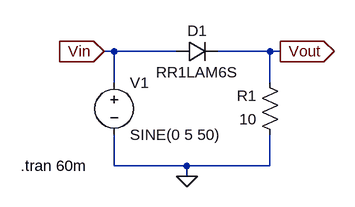
[diagram p0: schematic Draft15.asc]
Draft15.asc, the LTspice schematic file:
Version 4
SHEET 1 880 680
WIRE 16 64 0 64
WIRE 112 64 16 64
WIRE 256 64 176 64
WIRE 272 64 256 64
WIRE 16 112 16 64
WIRE 256 112 256 64
WIRE 16 240 16 192
WIRE 128 240 16 240
WIRE 256 240 256 192
WIRE 256 240 128 240
WIRE 128 256 128 240
FLAG 128 256 0
FLAG 272 64 Vout
IOPIN 272 64 Out
FLAG 0 64 Vin
IOPIN 0 64 In
SYMBOL diode 112 80 R270
WINDOW 0 32 32 VTop 2
WINDOW 3 0 32 VBottom 2
SYMATTR InstName D1
SYMATTR Value RR1LAM6S
SYMBOL res 272 208 R180
WINDOW 0 36 76 Left 2
WINDOW 3 36 40 Left 2
SYMATTR InstName R1
SYMATTR Value 10
SYMBOL voltage 16 96 R0
WINDOW 123 0 0 Left 0
WINDOW 39 0 0 Left 0
SYMATTR InstName V1
SYMATTR Value SINE(0 5 50)
TEXT -128 240 Left 2 !.tran 60m

The netlist it stands for:
* Draft15.asc
D1 Vin Vout RR1LAM6S
R1 0 Vout 10
V1 Vin 0 SINE(0 5 50)
.model D D
.lib standard.dio
.tran 60m
.backanno
.end

* Results of the author's LTspice run, read from the files saved beside the schematic
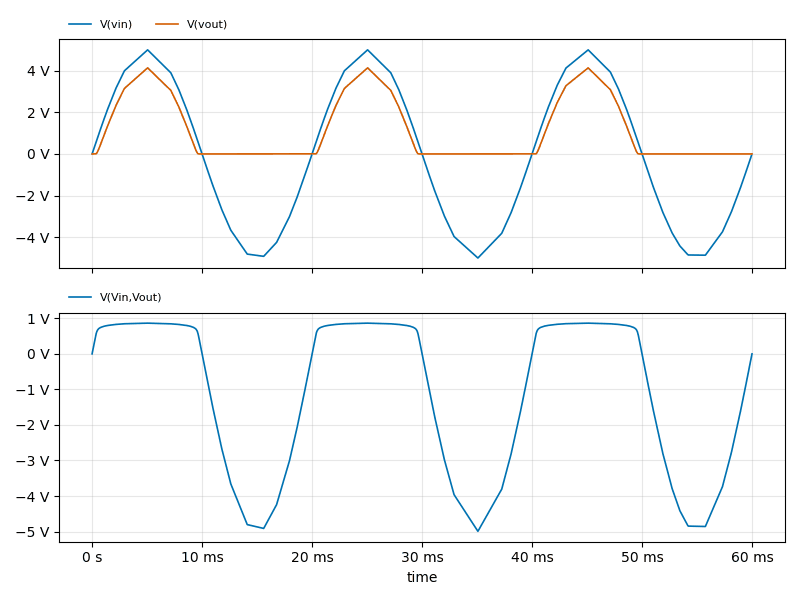
[diagram p1: Transient Analysis of Draft15.asc, plotted from the saved traces]
* Transient Analysis, 1 run:
*   V(vin): min -4.992 V, max 4.994 V, average -10.29 mV, rms 3.472 V, last 0 V
*   V(vout): min 0 V, max 4.13 V, average 1.164 V, rms 1.922 V, last 0 V
*   V(Vin,Vout): min -4.992 V, max 863.7 mV, average -1.174 V, rms 2.53 V, last 0 V